# Altium schematic sheet tb6612fng.SchDoc
size A4; SheetNumber: 4; SheetTotal: 4
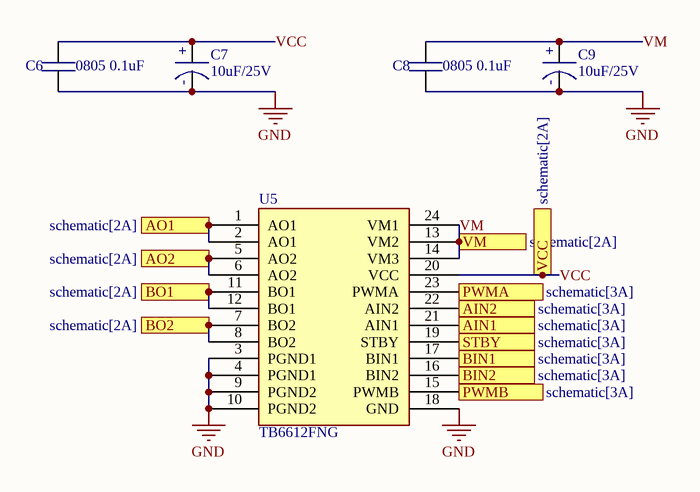
[diagram p0: tb6612fng.SchDoc]

## Parts
C6  0805 0.1uF  [CAPACITOR 0805]
C7  10uF/25V  [10uF/25V 4mm]
C8  0805 0.1uF  [CAPACITOR 0805]
C9  10uF/25V  [10uF/25V 4mm]
U5  TB6612FNG  [TB6612FNG]

## Ports
AIN1 (see schematic[3A]), AIN2 (see schematic[3A]), AO1 (see schematic[2A]), AO2 (see schematic[2A]), BIN1 (see schematic[3A]), BIN2 (see schematic[3A]), BO1 (see schematic[2A]), BO2 (see schematic[2A]), PWMA (see schematic[3A]), PWMB (see schematic[3A]), STBY (see schematic[3A]), VCC (see schematic[2A]), VM (see schematic[2A])

## Nets
GND: C6.1 C7.1 C8.1 C9.1 U5.3(PGND1) U5.4(PGND1) U5.9(PGND2) U5.10(PGND2) U5.18(GND)
AIN1: U5.21(AIN1) ; port AIN1
AIN2: U5.22(AIN2) ; port AIN2
AO1: U5.1(AO1) U5.2(AO1) ; port AO1
AO2: U5.5(AO2) U5.6(AO2) ; port AO2
BIN1: U5.17(BIN1) ; port BIN1
BIN2: U5.16(BIN2) ; port BIN2
BO1: U5.11(BO1) U5.12(BO1) ; port BO1
BO2: U5.7(BO2) U5.8(BO2) ; port BO2
PWMA: U5.23(PWMA) ; port PWMA
PWMB: U5.15(PWMB) ; port PWMB
STBY: U5.19(STBY) ; port STBY
VCC: C6.2 C7.2 U5.20(VCC) ; port VCC
VM: C8.2 C9.2 U5.13(VM2) U5.14(VM3) U5.24(VM1) ; port VM

## Notes on the sheet
- (in symbol 10uF/25V) +; -

## Library data of the parts
C6 C8 = CAPACITOR 0805
C7 C9 = 10uF/25V: Electrolytic Capacitor 10uF/25V
U5 = TB6612FNG: Dual Motor Driver 2.5-13.5V 3.2A Peak SSOP24-P-300-0.65A; ComponentLink1Description: Datasheet; ComponentLink1URL: https://www.mouser.com/datasheet/2/408/TB6612FNG_datasheet_en_20141001-708260.pdf; Mouser PN: 757-TB6612FNGC8EL; Digikey PN: TB6612FNGC8ELCT-ND